# EAGLE design ArduinoCurveTracer3_V1 (EAGLE 8.3.2)
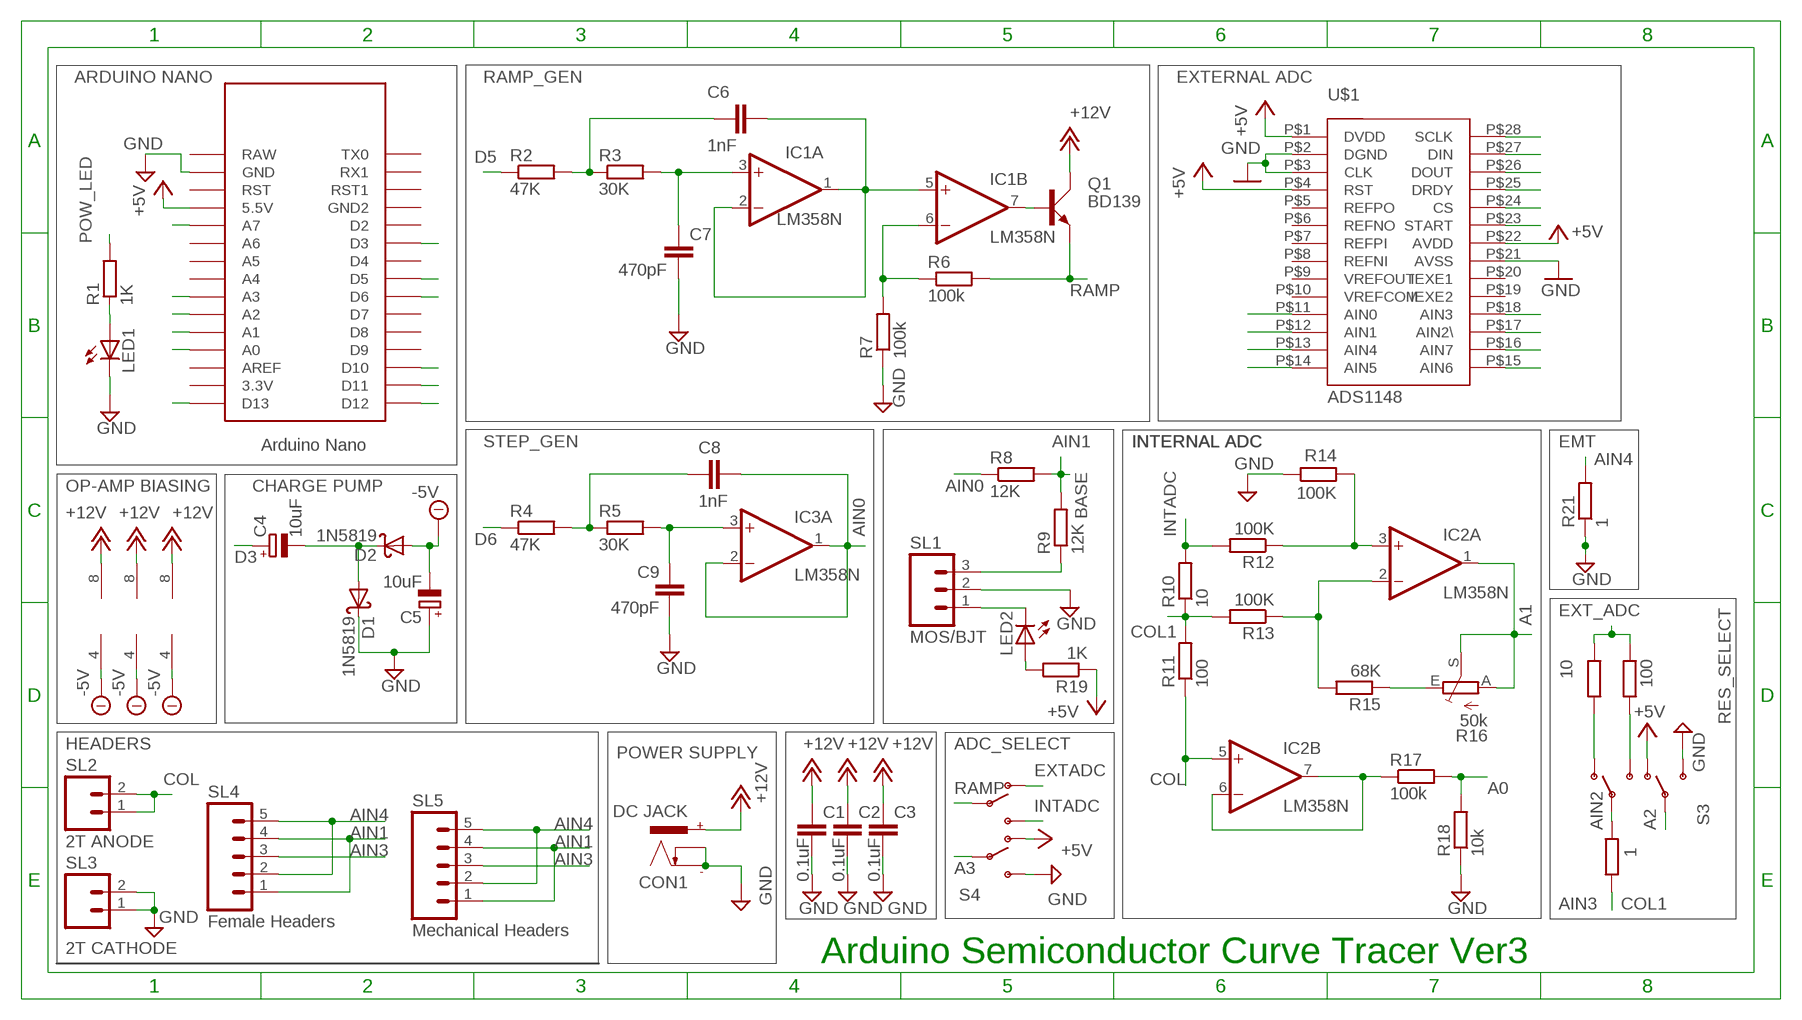
[diagram p0: schematic, sheet 1]

## Parts
ARDUINONANO  NANO  [NANO]
C1  0.1uF  C-EUC0805  [C0805]
C2  0.1uF  C-EUC0805  [C0805]
C3  0.1uF  C-EUC0805  [C0805]
C4  10uF  CPOL-EUE2.5-5  [E2,5-5]
C5  10uF  CPOL-EUE2.5-5  [E2,5-5]
C6  1nF  C-EUC0603  [C0603]
C7  470pF  C-EU025-024X044  [C025-024X044]
C8  1nF  C-EU025-024X044  [C025-024X044]
C9  470pF  C-EUC0805  [C0805]
CON1  DC JACK  POWER_CON  [NEB21R]
D1  1N5819  [DO41-10]
D2  1N5819  [DO41-10]
IC1  LM358N  [DIL08]
IC2  LM358N  [DIL08]
IC3  LM358N  [DIL08]
LED1  LED3MM  [LED3MM]
LED2  LED3MM  [LED3MM]
Q1  BD139  [TO126AV]
R1  1K  R-EU_0207/10  [0207/10]
R2  47K  R-EU_0207/10  [0207/10]
R3  30K  R-EU_0204/7  [0204/7]
R4  47K  R-EU_0204/7  [0204/7]
R5  30K  R-EU_0204/7  [0204/7]
R6  100k  R-EU_M0805  [M0805]
R7  100k  R-EU_0207/7  [0207/7]
R8  12K  R-EU_0207/10  [0207/10]
R9  12K  R-EU_0207/10  [0207/10]
R10  10  R-EU_0207/10  [0207/10]
R11  100  R-EU_0207/10  [0207/10]
R12  100K  R-EU_0207/10  [0207/10]
R13  100K  R-EU_0207/10  [0207/10]
R14  100K  R-EU_0204/7  [0204/7]
R15  68K  R-EU_0204/7  [0204/7]
R16  50k  TRIM_EU-S64W  [S64W]
R17  100k  R-EU_0207/7  [0207/7]
R18  10k  R-EU_0204/7  [0204/7]
R19  1K  R-EU_0207/10  [0207/10]
R21  1  R-EU_0207/10  [0207/10]
R22  10  R-EU_0204/7  [0204/7]
R23  100  R-EU_0204/7  [0204/7]
R24  1  R-EU_0204/7  [0204/7]
S3  SWITCH-SPDTPTH2  [SWITCHE-DPDT]
S4  SWITCH-SPDTPTH2  [SWITCHE-DPDT]
SL1  MOS/BJT  M03  [03P]
SL2  2T ANODE  M02  [02P]
SL3  2T CATHODE  M02  [02P]
SL4  Female Headers  M05  [05P]
SL5  Mechanical Headers  M05  [05P]
U$1  ADS1148  [TSSOP-28]

## Nets
+5V: ARDUINONANO.5V(5.5V) R19.1 S3.4 S4.4 U$1.P$1(DVDD) U$1.P$4(RST) U$1.P$22(AVDD)
+12V: C1.1 C2.1 C3.1 CON1.+ IC1.8(P:V+) IC2.8(P:V+) IC3.8(P:V+) Q1.C
-5V: C5.- D2.A IC1.4(P:V-) IC2.4(P:V-) IC3.4(P:V-)
A0: ARDUINONANO.A0 R17.2 R18.2
A1: ARDUINONANO.A1 IC2.1(A:OUT) R16.A R16.S
A2: ARDUINONANO.A2 S3.5
A3: ARDUINONANO.A3 S4.5
AIN0: C8.2 IC3.1(A:OUT) IC3.2(A:-IN) R8.1 U$1.P$11(AIN0)
AIN1: R8.2 R9.2 SL4.1 SL4.4 SL5.1 SL5.4 U$1.P$12(AIN1)
AIN2: R24.1 S3.2 U$1.P$17(AIN2\)
AIN3: R10.1 R11.2 R13.2 R24.2 SL4.3 SL5.3 U$1.P$18(AIN3)
AIN4: R21.2 SL4.2 SL4.5 SL5.2 SL5.5 U$1.P$13(AIN4)
AIN5: U$1.P$14(AIN5)
AIN6: U$1.P$15(AIN6)
AIN7: U$1.P$16(AIN7)
COL: IC2.5(B:+IN) R11.1 SL2.1 SL2.2
CS: ARDUINONANO.D10 U$1.P$24(CS)
D3: ARDUINONANO.D3 C4.+
D5: ARDUINONANO.D5 R2.1
D6: ARDUINONANO.D6 R4.1
DIN: ARDUINONANO.D11 U$1.P$27(DIN)
DOUT: ARDUINONANO.D12 U$1.P$26(DOUT)
DRDY: U$1.P$25(DRDY)
EXTADC: R22.2 R23.2 S4.1
GND: ARDUINONANO.GND C1.2 C2.2 C3.2 C5.+ C7.2 C9.1 CON1.- CON1.C D1.C LED1.K(C) R7.1 R14.1 R18.1 R21.1 S3.6 S4.6 SL1.2 SL3.1 SL3.2 U$1.P$2(DGND) U$1.P$3(CLK) U$1.P$21(AVSS)
INTADC: R10.2 R12.2 S4.3
N$1: C4.- D1.A D2.C
N$2: R9.1 SL1.3
N$3: C6.1 R2.2 R3.1
N$4: C7.1 IC1.3(A:+IN) R3.2
N$6: IC1.7(B:OUT) Q1.B
N$7: LED2.K(C) SL1.1
N$8: IC1.6(B:-IN) R6.1 R7.2
N$9: C8.1 R4.2 R5.1
N$10: C9.2 IC3.3(A:+IN) R5.2
N$11: LED2.A R19.2
N$12: R22.1 S3.1
N$13: IC2.3(A:+IN) R12.1 R14.2
N$14: IC2.2(A:-IN) R13.1 R15.2
N$16: IC2.6(B:-IN) IC2.7(B:OUT) R17.1
N$17: R15.1 R16.E
N$19: LED1.A R1.1
N$21: R23.1 S3.3
POW_LED: ARDUINONANO.A7 R1.2
RAMP: C6.2 IC1.1(A:OUT) IC1.2(A:-IN) IC1.5(B:+IN) Q1.E R6.2 S4.2
SCLK: ARDUINONANO.D13 U$1.P$28(SCLK)
START: U$1.P$23(START)
Unconnected: ARDUINONANO.3.3V ARDUINONANO.A4 ARDUINONANO.A5 ARDUINONANO.A6 ARDUINONANO.AREF ARDUINONANO.D2 ARDUINONANO.D4 ARDUINONANO.D7 ARDUINONANO.D8 ARDUINONANO.D9 ARDUINONANO.GND1(GND2) ARDUINONANO.RAW ARDUINONANO.RST ARDUINONANO.RST1 ARDUINONANO.RX1 ARDUINONANO.TX0 IC3.5(B:+IN) IC3.6(B:-IN) IC3.7(B:OUT) U$1.P$5(REFPO) U$1.P$6(REFNO) U$1.P$7(REFPI) U$1.P$8(REFNI) U$1.P$9(VREFOUT) U$1.P$10(VREFCOM) U$1.P$19(IEXE2) U$1.P$20(IEXE1)

## Notes on the sheet
- ARDUINO NANO | RAMP_GEN | EXTERNAL ADC
- POW_LED
- STEP_GEN | AIN1 | INTERNAL ADC | INTERNAL ADC | INTERNAL ADC | EMT
- AIN4
- OP-AMP BIASING | CHARGE PUMP
- BASE
- INTADC
- RES_SELECT
- EXT_ADC
- COL1
- HEADERS | ADC_SELECT
- POWER SUPPLY
- EXTADC
- RAMP
- INTADC
- AIN2 | A2
- A3
- AIN3 | COL1
- Arduino Semiconductor Curve Tracer Ver3

## Library data of the parts
ARDUINONANO = Arduino-clone:NANO: Arduino Nano
C1-C3 C6-C9 = rcl:C-EU: CAPACITOR, European symbol
C4 C5 = rcl:CPOL-EU: POLARIZED CAPACITOR, European symbol
CON1 = CEDTv83:POWER_CON: DC Power Connector
D1 D2 = CEDTv83:1N5819: DIODE general purpose rectifier, 1 A
IC1-IC3 = CEDTv81:LM358: OP AMP also LM158; LM258; LM2904 Source: http://cache.national.com/ds/LM/LM158.pdf
LED1 LED2 = CEDT_JANUARY_2015_v5_a:LED
Q1 = transistor-power:BD139: NPN TRANSISTOR
R1-R5 R10 R12-R15 R18 R19 R21-R24 = rcl:R-EU_: RESISTOR, European symbol
R6 R7 R17 = TalkingTom_FINAL:R-EU_: RESISTOR, European symbol
R8 R9 R11 = resistor:R-EU_: RESISTOR, European symbol
R16 = pot:TRIM_EU-: POTENTIOMETER
S3 S4 = TalkingTom_FINAL(1):SWITCH-SPDT: SPDT Switch Simple slide switch, Spark Fun Electronics SKU : COM-00102 DPDT SMT slide switch, AYZ0202, SWCH-08179
SL1 = con-amp-quick:M03: AMP QUICK CONNECTOR; OC_FARNELL: unknown; OC_NEWARK: unknown
SL2 SL3 = CEDTv81:M02: AMP QUICK CONNECTOR
SL4 SL5 = con-amp-quick:M05: AMP QUICK CONNECTOR; OC_FARNELL: unknown; OC_NEWARK: unknown
U$1 = ads11xx:ADS1148: For BOB of ADS1148 ONLY! Visit for BoB:- here <https://github.com/ticepd/Latest-eagle-files/tree/master/28%20pin%20TSSOP> Visit here for more details <cedtnsit.in>

## Net classes
0 +12V: width 0.61 mm, drill 0.61 mm, clearance 0.61 mm
1 -5V: width 0.61 mm, drill 0.61 mm, clearance 0.61 mm

## Board
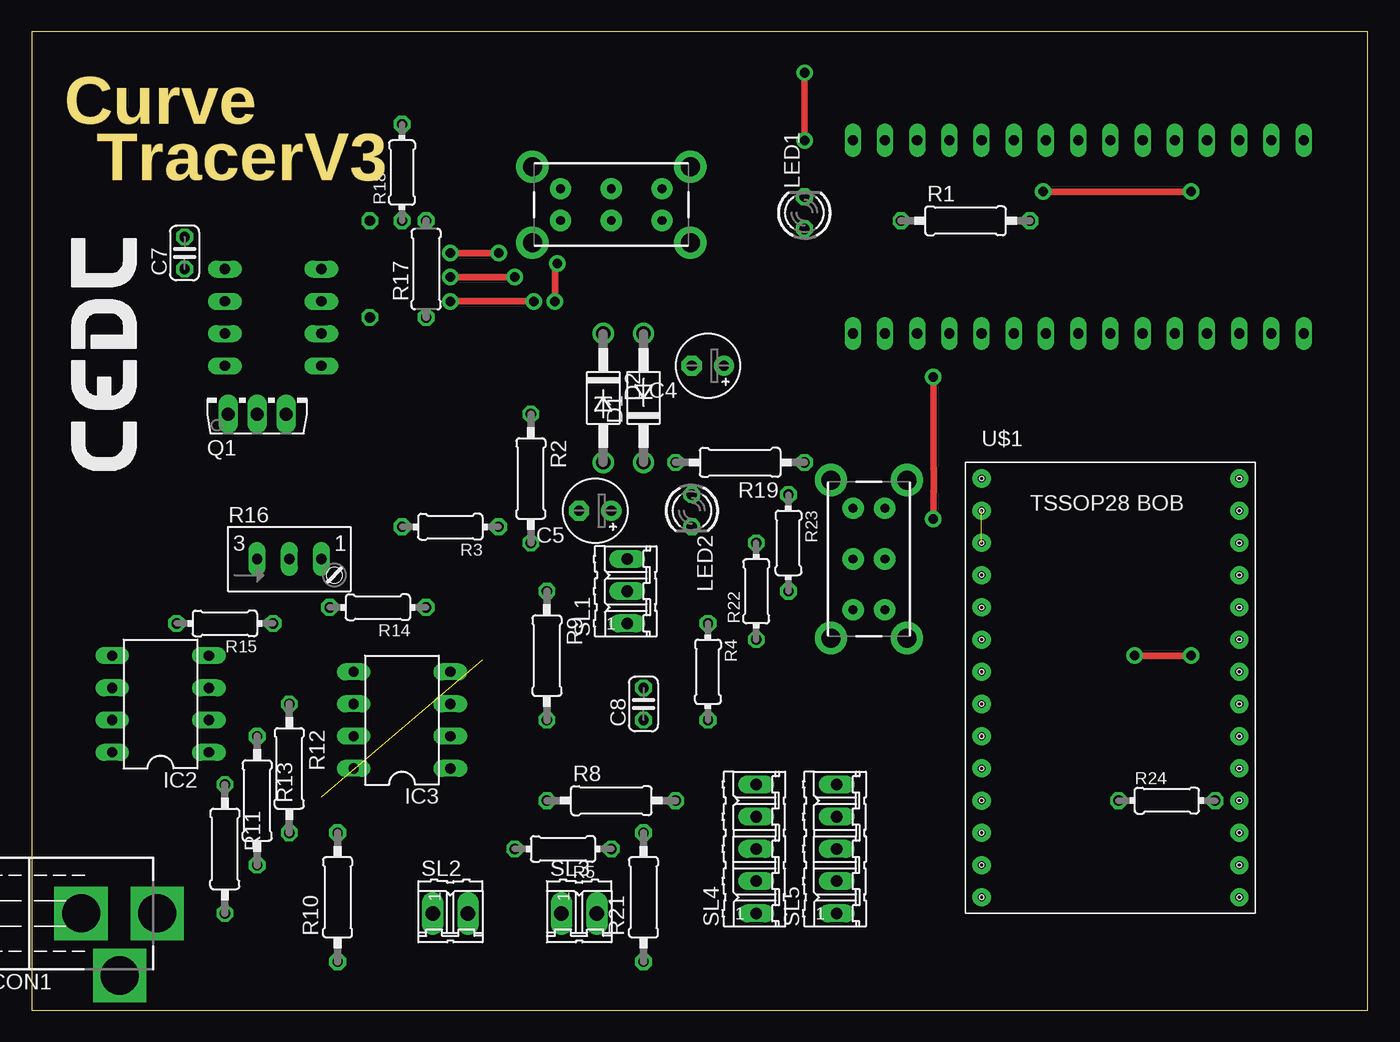
[diagram p1: board, top side]
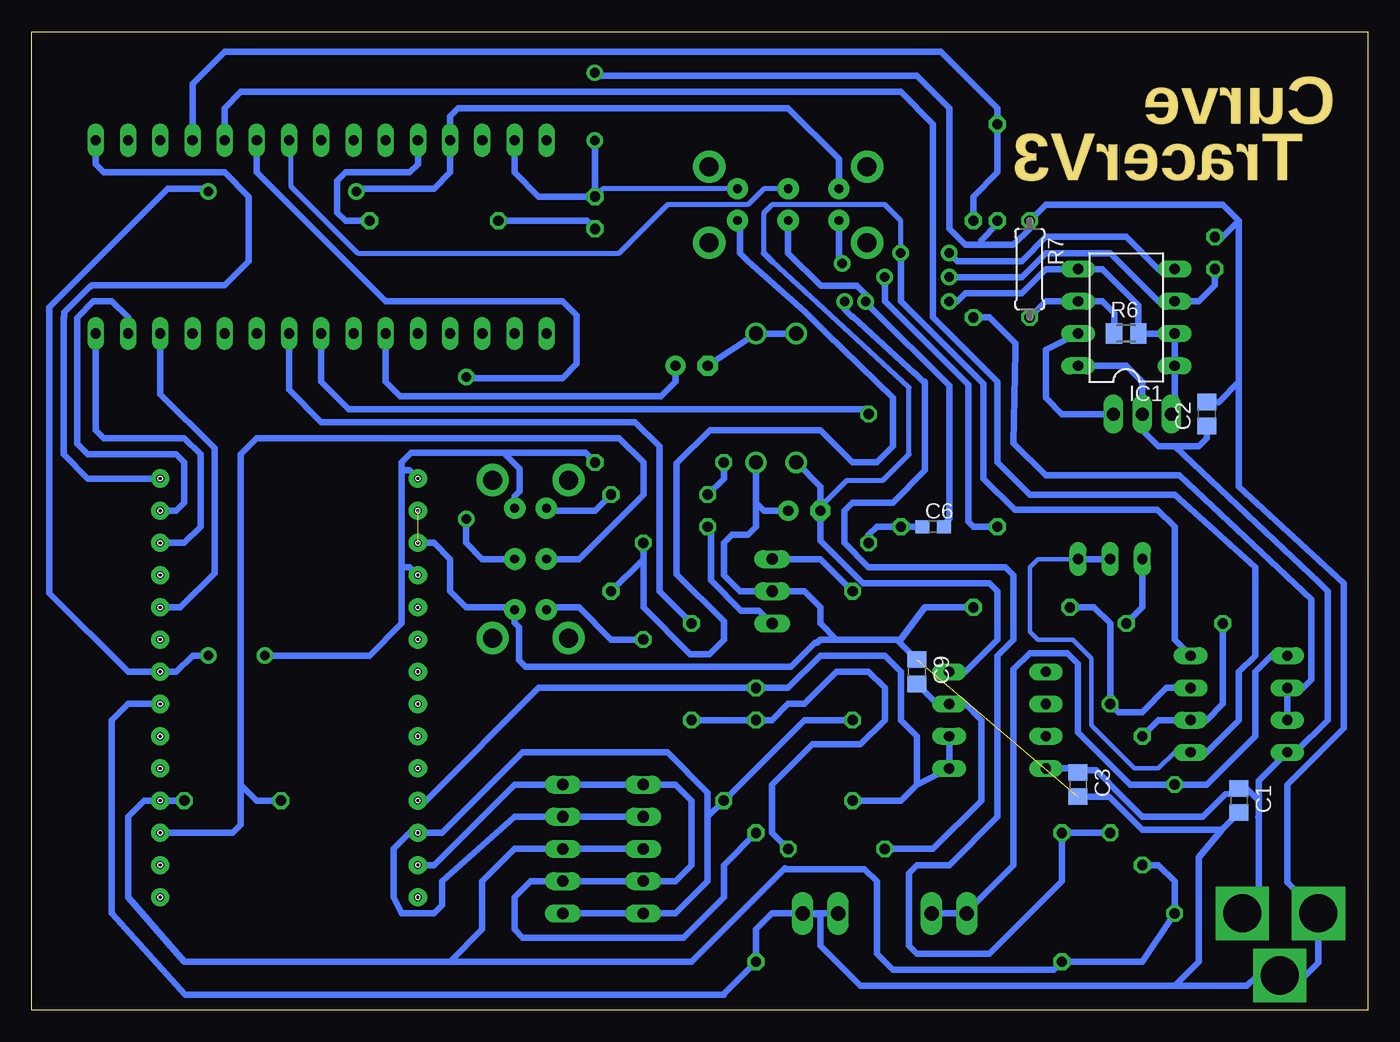
[diagram p2: board, bottom side, seen from below]

Size 105.39 x 77.14 mm. Coordinates in mm from the lower left corner, seen from the top.
Outline: 0,0 105.39,0 105.39,77.14 0,77.14 0,0
Copper layers (1*16): Top 0.035mm / dielectric 1.5mm / Bottom 0.035mm
Design rules "default": minimum track width 6mil, minimum drill 0.35mm, track to track 6mil, track to pad 6mil, pad to pad 6mil, via to via 6mil, smd to smd 6mil, copper to edge 40mil, drill to drill 6mil, minimum pad ring 10mil, minimum via ring 8mil, stop-mask expansion 4mil, vias tented up to drill 0mil, thermal gap 10mil

### Footprints (pad centres in the part's own frame; a part is rotated, then mirrored left to right if it is on the bottom)
NANO = drill 0.8 long: 3.3V -10.16,24.13; 5V -10.16,-1.27; A0 -10.16,19.05; A1 -10.16,16.51; A2 -10.16,13.97; A3 -10.16,11.43; A4 -10.16,8.89; A5 -10.16,6.35; A6 -10.16,3.81; A7 -10.16,1.27; AREF -10.16,21.59; D2 5.08,1.27; D3 5.08,3.81; D4 5.08,6.35; D5 5.08,8.89; D6 5.08,11.43; D7 5.08,13.97; D8 5.08,16.51; D9 5.08,19.05; D10 5.08,21.59; D11 5.08,24.13; D12 5.08,26.67; D13 -10.16,26.67; GND -10.16,-6.35; GND1 5.08,-1.27; RAW -10.16,-8.89; RST -10.16,-3.81; RST1 5.08,-3.81; RX1 5.08,-6.35; TX0 5.08,-8.89
C0805 = smd 1.3 x 1.5: 1 -0.95,0; 2 0.95,0
E2,5-5 = drill 0.813 pad 1.6: + -1.27,0 | drill 0.813 pad 1.6 octagon: - 1.27,0
C0603 = smd 1.1 x 1: 1 -0.85,0; 2 0.85,0
C025-024X044 = drill 0.813 octagon: 1 -1.27,0; 2 1.27,0
NEB21R = drill 3 pad 4.2 square: + 0,3.54; - 0,-2.46; C 4.9,0.59
DO41-10 = drill 1.118: A 5.08,0; C -5.08,0
DIL08 = drill 0.813 long: 1 -3.81,-3.81; 2 -1.27,-3.81; 3 1.27,-3.81; 4 3.81,-3.81; 5 3.81,3.81; 6 1.27,3.81; 7 -1.27,3.81; 8 -3.81,3.81
LED3MM = drill 0.813 octagon: A -1.27,0; K 1.27,0
TO126AV = drill 1.016 long: B 2.286,-1.27; C 0,-1.27; E -2.286,-1.27
0207/10 = drill 0.813 octagon: 1 -5.08,0; 2 5.08,0
0204/7 = drill 0.813 octagon: 1 -3.81,0; 2 3.81,0
M0805 = smd 1.3 x 1.6: 1 -0.95,0; 2 0.95,0
0207/7 = drill 0.813 octagon: 1 -3.81,0; 2 3.81,0
S64W = drill 0.813 long: A 2.54,1.27; E -2.54,1.27; S 0,1.27
SWITCHE-DPDT = drill 0.7 pad 1.676: 1 -4,1.25; 2 0,1.25; 3 4,1.25; 4 4,-1.25; 5 0,-1.25; 6 -4,-1.25 | drill 1.5 pad 2.54: P$1 -6.23,3; P$2 -6.23,-3; P$3 6.23,3; P$4 6.23,-3
03P = drill 0.914 long: 1 -2.54,0; 2 0,0; 3 2.54,0
02P = drill 1.143 long: 1 -1.397,0; 2 1.397,0
05P = drill 0.914 long: 1 -5.08,0; 2 -2.54,0; 3 0,0; 4 2.54,0; 5 5.08,0
TSSOP-28 = drill 0.6 pad 1.422: P$1 -10.16,15.24; P$2 -10.16,12.7; P$3 -10.16,10.16; P$4 -10.16,7.62; P$5 -10.16,5.08; P$6 -10.16,2.54; P$7 -10.16,0; P$8 -10.16,-2.54; P$9 -10.16,-5.08; P$10 -10.16,-7.62; P$11 -10.16,-10.16; P$12 -10.16,-12.7; P$13 -10.16,-15.24; P$14 -10.16,-17.78; P$15 10.16,-17.78; P$16 10.16,-15.24; P$17 10.16,-12.7; P$18 10.16,-10.16; P$19 10.16,-7.62; P$20 10.16,-5.08; P$21 10.16,-2.54; P$22 10.16,0; P$23 10.16,2.54; P$24 10.16,5.08; P$25 10.16,7.62; P$26 10.16,10.16; P$27 10.16,12.7; P$28 10.16,15.24 | hole 0.35: -10.16,2.54; -10.16,5.08; -10.16,7.62; -10.16,10.16; -10.16,12.7; -10.16,15.24; -10.16,0; -10.16,-2.54; -10.16,-5.08; -10.16,-7.62; -10.16,-10.16; -10.16,-12.7; -10.16,-15.24; -10.16,-17.78; 10.16,2.54; 10.16,5.08; 10.16,7.62; 10.16,10.16; 10.16,12.7; 10.16,15.24; 10.16,0; 10.16,-2.54; 10.16,-5.08; 10.16,-7.62; 10.16,-10.16; 10.16,-12.7; 10.16,-15.24; 10.16,-17.78

### Placement (x,y rotation side)
ARDUINONANO  73.66,58.42 270 top
C1  10.16,16.51 270 bottom
C2  12.7,46.99 90 bottom
C3  22.86,17.78 270 bottom
C4  53.34,50.8 180 top
C5  44.45,39.37 180 top
C6  34.29,38.1 0 bottom
C7  12.06,59.69 90 top
C8  48.26,24.13 90 top
C9  35.56,26.67 270 bottom
CON1  6.35,7.62 270 top
D1  48.26,48.26 90 top
D2  45.09,48.26 270 top
IC1  19.05,54.61 90 bottom
IC2  10.16,24.13 90 top
IC3  29.21,22.86 90 top
LED1  60.96,62.87 90 top
LED2  52.07,39.37 270 top
Q1  17.78,48.26 0 top
R1  73.66,62.23 0 top
R2  39.37,41.91 270 top
R3  33.02,38.1 180 top
R4  53.34,26.67 270 top
R5  41.91,12.7 180 top
R6  19.05,53.34 0 bottom
R7  26.67,58.42 270 bottom
R8  45.72,16.51 0 top
R9  40.64,27.94 270 top
R10  24.13,8.89 90 top
R11  15.24,12.7 270 top
R12  20.32,19.05 270 top
R13  17.78,16.51 270 top
R14  27.3,31.75 180 top
R15  15.24,30.48 180 top
R16  20.32,34.29 0 top
R17  31.11,58.42 90 top
R18  29.21,66.04 90 top
R19  55.88,43.18 180 top
R21  48.26,8.89 90 top
R22  57.15,33.02 90 top
R23  59.69,36.83 270 top
R24  89.53,16.51 0 top
S3  66.04,35.56 90 top
S4  45.72,63.5 180 top
SL1  46.99,33.02 90 top
SL2  33.02,7.62 0 top
SL3  43.18,7.62 0 top
SL4  57.15,12.7 90 top
SL5  63.5,12.7 90 top
U$1  85.09,26.67 0 top
U$2  [LOGO-CEDT-SILK-18MM]  8.26,42.55 90 top

### Tracks (layer width: path | path; a pad name or v marks a point on that pad's centre or on a via)
+5V  (via drill 0.75 pad 1.3)
  Top 0.508: v79.77,64.53 91.2,64.53 91.44,64.77 v91.44,64.53 | v87,27.94 v91.44,27.94
  Bottom 0.508: S4.4 41.72,67.12 45.72,71.12 71.75,71.12 72.39,70.48 ARDUINONANO.5V 72.39,66.04 73.66,64.77 79.52,64.77 | 79.52,64.77 80.01,64.77 | 76.2,42.55 76.2,34.92 | 76.2,42.55 76.2,43.18 75.46,43.92 68.16,43.92 | 76.2,34.92 76.2,30.48 78.74,27.94 v87,27.94 | U$1.P$4 75.56,34.92 76.2,34.92 | U$1.P$1 75.56,42.55 76.2,42.55 | S3.4 67.29,40.52 66.91,40.91 66.91,42.67 68.16,43.92 | 68.16,43.92 61.7,43.92 R19.1 | 101.94,57.47 | 92.08,64.77 91.44,64.77 | 92.08,64.77 94.65,64.77 101.94,57.47 | 101.94,57.47 103.99,55.43 103.99,32.87 97.79,26.67 U$1.P$22 93.98,26.67 92.71,27.94 v91.44,27.94 | 79.52,64.77 v79.77,64.53 | v91.44,64.53 91.83,64.53 92.08,64.77
+12V
  Bottom 0.508: C1.1 10.16,17.78 | 8.6,15.24 8.6,16.51 | 19.39,16.85 17.78,15.24 13.03,15.24 11.25,17.02 10.16,17.14 C1.1 | 19.39,16.85 | 8.6,15.24 8.62,15.22 | 22.55,18.41 C3.1 23.02,18.89 | 23.02,18.89 23.18,19.05 IC3.8 | 23.02,18.89 21.43,18.89 19.39,16.85 | IC1.8 19.05,50.8 17.78,49.53 Q1.C 17.78,45.72 16.51,44.45 15.24,44.45 | 15.24,44.45 3.83,33.68 3.17,33.02 3.17,22.86 5.71,20.32 IC2.8 8.6,18.07 8.6,16.51 | 15.24,44.45 13.34,44.45 12.7,45.09 C2.1 | C1.1 9.55,17.46 8.6,16.51 | 8.6,15.24 8.6,8.91 CON1.+
-5V  (via drill 0.75 pad 1.3)
  Top 0.508: v33.02,59.69 v36.83,59.69
  Bottom 0.356: C5.- 43.03,39.52
  Bottom 0.406: v36.83,59.69 36.83,62.23 38.1,63.5 46.99,63.5 47.62,62.87 47.62,59.69 | 43.03,39.83 41.1,41.76 38.25,41.76 36.2,43.81 36.2,49.07 46.99,59.05
  Bottom 0.508: IC2.4 15.24,29.21 15.24,38.1 16.59,39.45 27.86,39.45 30.31,41.91 30.31,49.36 36.83,55.88 v36.83,59.69 | IC3.4 31.75,26.67 29.21,29.21 29.21,33.02 29.84,33.66 39.84,33.66 43.18,37 C5.- 43.18,41.27 D2.A | IC1.4 16.51,58.42 19.05,60.96 25.4,60.96 27.3,59.05 32.38,59.05 v33.02,59.69 | 43.03,39.52 43.03,39.83 | 46.99,59.05 47.62,59.69
A0
  Bottom 0.508: R17.2 31.11,64.14 29.21,66.04 R18.2 29.21,71.12 33.66,75.56 90.17,75.56 92.71,73.03 ARDUINONANO.A0
A1
  Bottom 0.356: IC2.1 15.24,20.32 16.51,19.05 18.41,19.05 21.82,22.45 21.82,27.74 23.27,29.18 23.47,29.18 23.5,29.21 26.04,29.21 26.67,29.84 26.67,34.92 26.04,35.56 R16.A
  Bottom 0.508: 14.14,20.32 IC2.1 12.7,20.32 10.16,22.86 10.16,26.67 8.89,27.94 8.89,34.92 15.24,40.64 26.67,40.64 29.21,43.18 29.21,49.53 34.29,54.61 34.29,69.85 36.83,72.39 88.9,72.39 90.17,71.12 ARDUINONANO.A1 | R16.A R16.S
A2  (via drill 0.75 pad 1.3)
  Top 0.508: v71.12,38.73 71.12,40.85 71.17,40.91 71.17,42.67 71.12,42.73 v71.12,49.9
  Bottom 0.508: ARDUINONANO.A2 87.63,66.04 77.47,55.88 63.5,55.88 62.4,54.78 62.4,50.97 63.53,49.83 70.48,49.83 | 67.29,34.91 S3.5 69.85,35.56 71.12,36.83 v71.12,38.73 | 70.48,49.83 71.12,49.83 | v71.12,49.9 70.55,49.9 70.48,49.83
A3
  Bottom 0.406: S4.5 47.65,64.75 48.9,63.5 55.24,63.5 59.05,59.69 79.7,59.69 84.94,64.92 84.94,68.42
  Bottom 0.508: 84.94,68.42 ARDUINONANO.A3
AIN0
  Bottom 0.508: IC3.2 IC3.1 35.56,17.78 | 35.56,17.78 36.83,16.51 R8.1 | 35.56,17.78 35.56,21.59 36.83,22.86 36.83,26.67 38.1,27.94 43.18,27.94 45.72,25.4 C8.2 65.41,25.4 74.3,16.51 U$1.P$11
AIN1
  Bottom 0.508: SL4.4 SL5.4 67.31,15.24 73.03,10.16 73.03,8.26 73.66,7.62 76.2,7.62 76.83,8.89 76.83,12.7 75.56,13.97 U$1.P$12 73.03,13.97 66.67,20.32 55.24,20.32 52.07,17.14 52.07,15.24 | SL5.1 SL4.1 54.61,7.62 52.07,10.16 52.07,15.24 | 52.07,15.24 R8.2 44.45,22.86 R9.2
AIN2
  Bottom 0.508: S3.2 62.23,35.56 57.15,40.64 57.15,43.18 59.05,45.09 87.63,45.09 88.9,43.81 88.9,17.78 | 88.9,17.78 87.63,16.51 R24.1 | 88.9,17.78 88.9,14.61 89.53,13.97 U$1.P$17
AIN3
  Bottom 0.508: SL4.3 SL5.3 67.31,12.7 69.85,10.16 69.85,6.35 72.39,3.81 | 72.39,3.81 93.34,3.81 97.79,8.89 97.79,15.24 96.52,16.51 U$1.P$18 R24.2 | R13.2 16.51,11.43 15.24,10.16 R11.2 17.78,3.81 R10.1 24.77,3.17 37.47,3.17 38.73,4.45 38.73,10.16 39.69,11.11 46.04,11.11 | 72.39,3.81 53.34,3.81 46.04,11.11 | 46.04,11.11 45.97,11.18
AIN4
  Bottom 0.508: R21.2 50.8,11.43 50.8,8.89 53.98,5.71 66.67,5.71 67.31,6.35 67.31,8.89 66.04,10.16 SL5.2 SL4.2 54.61,10.16 53.34,11.43 53.34,16.51 54.61,17.78 SL4.5 SL5.5 67.31,17.78 73.66,11.43 U$1.P$13
COL
  Bottom 0.508: IC2.5 7.62,27.94 8.89,26.67 8.89,21.59 12.7,17.78 R11.1 18.74,17.78 22.86,21.9 22.86,27.3 23.7,28.14 26.67,28.14 27.94,26.87 27.94,11.43 31.75,7.62 | 31.75,7.62 SL2.1 | 31.75,7.62 SL2.2
CS
  Bottom 0.508: ARDUINONANO.D10 95.25,48.57 90.96,44.28 90.96,34.45 93.66,31.75 U$1.P$24
D3
  Bottom 0.508: ARDUINONANO.D3 77.47,49.53 76.33,48.39 55.75,48.39 54.61,49.53 C4.+
D5
  Bottom 0.508: 55.24,47.37 80.39,47.37 82.55,49.53 ARDUINONANO.D5 | 55.24,47.37 54.99,47.37 | 55.24,47.37 39.75,47.37 R2.1
D6
  Bottom 0.508: R4.1 55.88,33.02 55.88,44.45 57.78,46.35 82.55,46.35 85.09,48.9 ARDUINONANO.D6
DIN
  Bottom 0.508: ARDUINONANO.D11 97.79,54.61 99.06,55.88 100.52,55.88 101.8,54.6 101.8,44.65 100.97,43.81 93.98,43.81 93.34,43.18 93.34,40.01 93.98,39.37 U$1.P$27
DOUT
  Bottom 0.508: ARDUINONANO.D12 100.33,45.72 99.69,45.09 93.34,45.09 92.08,43.81 92.08,38.1 93.34,36.83 U$1.P$26
EXTADC
  Bottom 0.508: R22.2 57.15,35.56 | 57.15,35.56 R23.2 | 57.15,35.56 57.15,31.75 53.47,28.07 51.94,28.07 50.8,29.21 50.8,30.65 54.53,34.37 54.53,43.1 51.9,45.72 43.18,45.72 40.64,43.18 38.73,43.18 37.47,44.45 37.47,48.26 42.75,53.41 44.38,55.04 48.9,59.05 49.53,59.69 49.53,61.59 49.72,61.78 S4.1
GND  (via drill 0.75 pad 1.3)  (2 unrouted)
  Top 0.508: v60.96,68.58 v60.96,73.9
  Bottom 0.406: LED1.K 60.34,64.75 S4.6
  Bottom 0.508: SL3.1 SL3.2 | SL3.2 46.99,7.62 48.26,6.35 R21.1 50.8,1.27 50.8,1.22 93.29,1.22 99.06,7.62 99.06,22.86 97.79,24.13 U$1.P$21 | SL3.2 43.18,7.49 43.18,5.08 40.01,1.91 15.24,1.91 | 41.91,29.21 43.18,29.21 43.43,28.96 43.6,28.96 45.51,27.05 66.42,27.05 66.96,27.59 66.96,30.19 67.29,30.53 S3.6 67.48,31.75 71.12,31.75 72.39,33.02 72.39,35.56 73.66,36.83 U$1.P$3 | 41.91,29.21 37.15,29.21 36.99,29.05 | 41.91,29.21 43.18,30.48 43.18,31.75 44.45,33.02 SL1.2 49.53,33.02 50.8,34.29 50.8,36.83 50.16,37.47 48.9,37.47 48.26,38.1 48.26,40.01 | C1.2 11.5,14.22 | 11.5,14.22 17.78,14.22 20.39,16.83 C3.2 | 36.99,29.05 C9.1 | R14.1 34.92,31.75 36.99,29.05 | 12.38,47.94 C2.2 11.75,47.94 10.16,49.53 | 10.16,49.53 10.16,41.27 1.91,33.66 1.91,22.23 6.35,17.78 6.35,10.08 CON1.- 3.89,3.73 5.08,2.54 6.76,2.54 CON1.C 8.71,2.72 9.53,1.91 15.24,1.91 | 10.16,49.53 10.16,62.23 | 10.16,62.23 11.43,63.5 25.4,63.5 R7.1 26.67,61.59 27.94,60.33 30.48,60.33 | ARDUINONANO.GND 67.31,66.04 65.41,64.14 LED1.K v60.96,68.58 | 10.16,62.23 11.43,60.96 C7.2 | C5.+ 47.62,39.37 48.26,40.01 | 48.26,40.01 D1.C | 11.5,14.22 13.34,12.06 13.34,3.81 15.24,1.91 | R18.1 29.21,61.98 30.48,60.71 30.48,60.33 | 30.48,60.33 31.75,60.33 33.02,61.59 33.02,71.12 35.56,73.66 60.96,73.66 v60.96,73.9
INTADC  (via drill 0.75 pad 1.3)
  Top 0.508: v41.27,55.88 41.27,59.05 v41.45,58.88
  Bottom 0.508: v41.27,55.88 41.27,55.24 40.69,54.66 40.59,54.66 35.76,50.19 35.73,50.19 35.41,49.89 35.05,49.53 34.92,49.53 34.92,42.55 37.47,40.01 40.64,40.01 41.27,39.37 41.27,36.83 39.37,34.92 28.57,34.92 27.94,34.29 27.94,29.21 29.21,27.94 29.21,15.24 33.02,11.43 35.56,11.43 36.2,10.79 36.2,5.08 35.56,4.45 29.84,4.45 24.13,10.16 R10.2 R12.2 | S4.3 41.72,59.15 v41.45,58.88
N$1
  Bottom 0.508: C4.- D1.A D2.C
N$2
  Bottom 0.508: SL1.3 43.18,35.56 R9.1
N$3
  Bottom 0.508: C6.1 R3.1 38.73,38.1 39.37,37.47 R2.2
N$4  (via drill 0.75 pad 1.3)
  Top 0.508: v33.02,57.78 v38.1,57.78
  Bottom 0.508: R3.2 31.11,38.1 31.5,38.48 31.5,44.44 31.51,44.45 31.51,49.29 38.1,55.88 v38.1,57.78 | IC1.3 13.97,55.88 | IC1.3 16.51,55.88 20.32,59.69 25.4,59.69 27.3,57.78 v33.02,57.78 | C7.1 12.06,57.15 13.34,55.88 IC1.3
N$6
  Bottom 0.508: IC1.7 25.4,52.07 25.4,48.26 24.13,46.99 Q1.B
N$7
  Bottom 0.508: SL1.1 48.01,31.5 49.44,31.5 51.82,33.87 51.82,37.85 LED2.K
N$8
  Bottom 0.508: IC1.6 22.54,55.88 | IC1.6 25.4,55.88 R7.2 | R6.1 20,54.92 20.95,55.88 IC1.6
N$9
  Bottom 0.508: R4.2 C8.1 46.99,22.86 45.72,24.13 44.45,24.13 41.91,26.67 39.37,26.67 38.1,25.4 38.1,22.86 40.01,20.95 43.81,20.95 46.99,17.78 46.99,13.97 R5.1
N$10
  Bottom 0.508: 35.24,25.4 C9.2 33.97,24.13 IC3.3 31.75,24.13 30.48,22.86 30.48,16.51 34.29,12.7 R5.2
N$11
  Bottom 0.508: R19.2 50.8,41.91 LED2.A
N$12
  Bottom 0.508: S3.1 64.6,31.75 62.23,31.75 59.69,29.21 R22.1
N$13
  Bottom 0.508: R14.2 21.59,31.75 20.32,30.48 R12.1 19.68,23.5 17.78,23.5 15.88,25.4 IC2.3
N$14
  Bottom 0.508: 15.24,22.86 IC2.2 | IC2.2 16.51,22.86 R13.1 | IC2.2 12.7,22.86 11.43,24.13 R15.2
N$16
  Bottom 0.508: IC2.7 IC2.6 5.08,25.4 4.45,26.04 4.45,32.38 14.86,42.16 25.4,42.16 27.94,44.7 27.81,51.94 27.81,52.58 29.84,54.61 R17.1
N$17
  Bottom 0.508: R16.E 17.78,31.75 R15.1
N$19
  Bottom 0.508: R1.1 61.59,62.23 LED1.A
N$21
  Bottom 0.508: R23.1 60.96,39.37 64.6,39.37 S3.3
POW_LED
  Bottom 0.508: ARDUINONANO.A7 74.93,66.67 75.56,66.04 80.64,66.04 81.28,65.41 81.28,62.87 80.64,62.23 R1.2
RAMP  (via drill 0.75 pad 1.3)
  Top 0.508: v39.61,55.88 39.37,55.88 v33.02,55.88
  Bottom 0.508: Q1.E 15.24,46.99 IC1.1 IC1.2 R6.2 18.1,55.56 20.95,58.42 IC1.5 25.4,58.42 27.3,56.52 31.75,56.52 32.38,55.88 v33.02,55.88 | C6.2 33.44,38.31 33.02,38.73 33.02,49.22 39.22,55.42 39.22,55.48 v39.61,55.88 39.61,56.43 40.3,57.12 43.15,57.12 45.72,59.69 S4.2
SCLK
  Bottom 0.508: U$1.P$28 100.97,41.91 102.87,43.81 102.87,54.61 102.81,54.67 102.81,55.02 100.83,57.01 100.76,57.01 100.62,57.15 90.17,57.15 88.27,59.05 88.27,64.14 90.17,66.04 99.69,66.04 100.33,66.67 ARDUINONANO.D13

### Text on the board
Dimension: Curve | TracerV3